# EAGLE schematic Electromagnet (EAGLE 9.3.0)
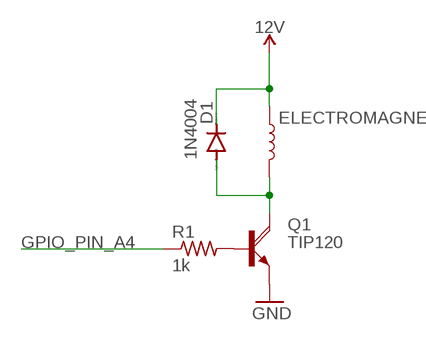
[diagram p0: schematic, sheet 1]

## Parts
D1  1N4004  [DO41-10]
ELECTROMAGNET  1.0μH  1.0μH-0805_WIDE-1.0μH-1.4A-0.07OHM  [0805-WIDE]
Q1  TIP120  [TO220AH]
R1  1k  R-US_0204/2V  [0204V]

## Nets
GND: Q1.E
GPIO_PIN_A4: R1.1
N$1: Q1.B R1.2
N$2: D1.A ELECTROMAGNET.2 Q1.C
VCC: D1.C ELECTROMAGNET.1 ; supply symbol labelled 12V

## Library data of the parts
D1 = diode:1N4004: DIODE general purpose rectifier, 1 A
ELECTROMAGNET = SparkFun-Coils:1.0μH: 2.2μH Inductor Resist changes in electrical current. Basically a coil of wire. SparkFun Products: SparkFun Edge - HX711 <https://www.sparkfun.com/products/15170>; PROD_ID: NDUC-14237
Q1 = transistor-power:TIP120: NPN DARLINGTON TRANSISTOR
R1 = PIC32_parts:R-US_: RESISTOR, American symbol; SPICEPREFIX: R